# Altium project Les Soupapes de l'Extrême.PrjPcb
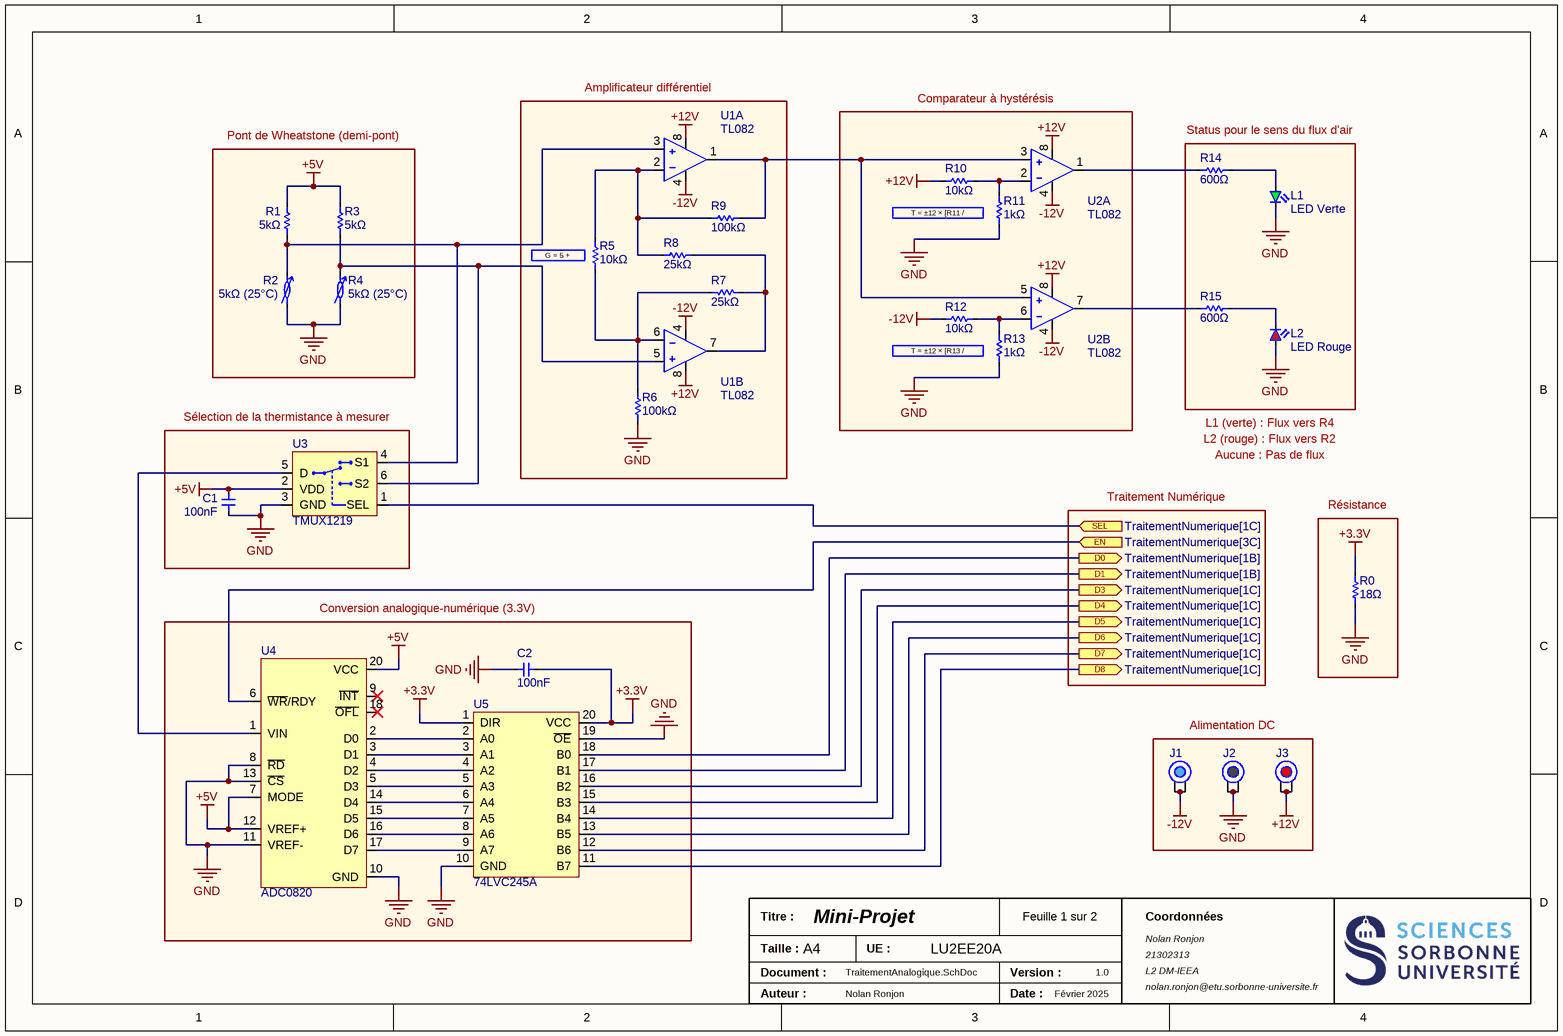
[diagram p0: TraitementAnalogique.SchDoc]
2 sheets, 66 parts. Net scope: flat (ports and power ports of the same name join across sheets).
Board file: Bobokeros.PcbDoc
Sheets:
  TraitementAnalogique.SchDoc
  TraitementNumerique.SchDoc

## Sheet TraitementAnalogique.SchDoc: Mini-Projet
size A4; Date: Février 2025; Author: Nolan Ronjon; CompanyName: Coordonnées; Address1: Nolan Ronjon; Address2: 21302313; Address3: L2 DM-IEEA; Address4: nolan.ronjon@etu.sorbonne-universite.fr; DocumentNumber: Schematic.SchDoc; Revision: 1.0; SheetNumber: 1; SheetTotal: 2; ProjectTitle: LU2EE20A; SPICEModelCacheHFZDDCNV: <root> / <DocumentId>HFZDDCNV</DocumentId> / </root>

### Parts
C1  value 100nF  [0603]  (hidden comment: Condensateur)
C2  value 100nF  [0603]  (hidden comment: Condensateur)
J1  Fiche Banane  [Fiche Banane]  (value not drawn)
J2  Fiche Banane  [Fiche Banane]  (value not drawn)
J3  Fiche Banane  [Fiche Banane]  (value not drawn)
L1  LED Verte  [0603 (Pol)]
L2  LED Rouge  [0603 (Pol)]
R0  value 18Ω  [Bornier]  (hidden comment: Resistance)
R1  value 5kΩ  [0603]  (hidden comment: Resistance)
R2  value 5kΩ (25°C)  [Bornier]  (hidden comment: CTN)
R3  value 5kΩ  [0603]  (hidden comment: Resistance)
R4  value 5kΩ (25°C)  [Bornier]  (hidden comment: CTN)
R5  value 10kΩ  [0603]  (hidden comment: Resistance)
R6  value 100kΩ  [0603]  (hidden comment: Resistance)
R7  value 25kΩ  [0603]  (hidden comment: Resistance)
R8  value 25kΩ  [0603]  (hidden comment: Resistance)
R9  value 100kΩ  [0603]  (hidden comment: Resistance)
R10  value 10kΩ  [0603]  (hidden comment: Resistance)
R11  value 1kΩ  [0603]  (hidden comment: Resistance)
R12  value 10kΩ  [0603]  (hidden comment: Resistance)
R13  value 1kΩ  [0603]  (hidden comment: Resistance)
R14  value 600Ω  [0603]  (hidden comment: Resistance)
R15  value 600Ω  [0603]  (hidden comment: Resistance)
U1  TL082  [SOIC-8]  (parts A,B of 2)
U2  TL082  [SOIC-8]  (parts A,B of 2)
U3  TMUX1219  [SOT-23-6]
U4  ADC0820  [DIP-20]
U5  74LVC245A  [TSSOP-20]

### Blocks framed on the sheet
Amplificateur différentiel: R5-R9 U1
Comparateur à hystérésis: R10-R13 U2
Pont de Wheatstone (demi-pont): R1-R4
Status pour le sens du flux d'air: L1 L2 R14 R15
Sélection de la thermistance à mesurer: C1 U3
Résistance: R0
Conversion analogique-numérique (3.3V): C2 U4 U5
Alimentation DC: J1-J3

### Ports
D0 (out, see TraitementNumerique[1B]), D1 (out, see TraitementNumerique[1B]), D3 (out, see TraitementNumerique[1C]), D4 (out, see TraitementNumerique[1C]), D5 (out, see TraitementNumerique[1C]), D6 (out, see TraitementNumerique[1C]), D7 (out, see TraitementNumerique[1C]), D8 (out, see TraitementNumerique[1C]), EN (in, see TraitementNumerique[3C]), SEL (in, see TraitementNumerique[1C])

### Nets
+3.3V: C2.2 R0.2 U5.1(DIR) U5.20(VCC)
+5V: C1.1 R1.2 R3.2 U3.2(VDD) U4.7(MODE) U4.12(VREF+) U4.20(VCC)
+12V: J3.1 J3.2 R10.2 U1.8(VCC+) U2.8(VCC+)
-12V: J1.1 J1.2 R12.2 U1.4(VCC-) U2.4(VCC-)
GND: C1.2 C2.1 J2.1 J2.2 L1.2(Cathode) L2.1(Anode) R0.1 R2.1 R4.1 R6.1 R11.1 R13.1 U3.3(GND) U4.8(~{RD}) U4.10(GND) U4.11(VREF-) U4.13(~{CS}) U5.10(GND) U5.19(~{OE})
NetL1_1: L1.1(Anode) R14.1
NetL2_2: L2.2(Cathode) R15.1
NetR1_1: R1.1 R2.2 U1.3(IN+) U3.4(S1)
NetR3_1: R3.1 R4.2 U1.5(IN+) U3.6(S2)
NetR5_1: R5.1 R6.2 R7.2 U1.6(IN-)
NetR5_2: R5.2 R8.2 R9.2 U1.2(IN-)
NetR7_1: R7.1 R8.1 U1.7(OUT)
NetR9_1: R9.1 U1.1(OUT) U2.3(IN+) U2.5(IN+)
NetR10_1: R10.1 R11.2 U2.2(IN-)
NetR12_1: R12.1 R13.2 U2.6(IN-)
NetR14_2: R14.2 U2.1(OUT)
NetR15_2: R15.2 U2.7(OUT)
NetU3_1: U3.1(SEL) ; port SEL
NetU3_5: U3.5(D) U4.1(VIN)
NetU4_2: U4.2(D0) U5.2(A0)
NetU4_3: U4.3(D1) U5.3(A1)
NetU4_4: U4.4(D2) U5.4(A2)
NetU4_5: U4.5(D3) U5.5(A3)
NetU4_6: U4.6(~{WR}/RDY) ; port EN
NetU4_14: U4.14(D4) U5.6(A4)
NetU4_15: U4.15(D5) U5.7(A5)
NetU4_16: U4.16(D6) U5.8(A6)
NetU4_17: U4.17(D7) U5.9(A7)
NetU5_11: U5.11(B7) ; port D8
NetU5_12: U5.12(B6) ; port D7
NetU5_13: U5.13(B5) ; port D6
NetU5_14: U5.14(B4) ; port D5
NetU5_15: U5.15(B3) ; port D4
NetU5_16: U5.16(B2) ; port D3
NetU5_17: U5.17(B1) ; port D1
NetU5_18: U5.18(B0) ; port D0

Not connected (* = marked no-connect by the designer): U4 9(~{INT})* 18(~{OFL})*

### Notes on the sheet
- T = ±12 × [R11 / (R10+R11)]
- (near R5) G = 5 + 200k/R5
- T = ±12 × [R13 / (R12+R13)]
- L1 (verte) : Flux vers R4
- L2 (rouge) : Flux vers R2
- Aucune : Pas de flux
- Traitement Numérique
- Titre :
- Taille :
- Auteur :
- Document :
- A4
- UE :
- Date :
- Version :

### Library data of the parts
J1 = Fiche Banane: Connecteur; Manufacturer Part: 24.243.5; JLCPCB Part: C7437325
J2 = Fiche Banane: Connecteur; Manufacturer Part: 24.243.2; JLCPCB Part: C7437322
J3 = Fiche Banane: Connecteur; Manufacturer Part: 24.243.1; JLCPCB Part: C7437321
L1 = LED Verte: LED; Manufacturer Part: XL-1608UGC-04; JLCPCB Part: C965804
L2 = LED Rouge: LED; Manufacturer Part: XL-1608SURC-06; JLCPCB Part: C965799
R0 = Resistance: Manufacturer Part: WJ500V-5.08-2P; JLCPCB Part: C8465
R2 R4 = CTN: Thermistance; Manufacturer Part: WJ500V-5.08-2P; JLCPCB Part: C8465
U1 U2 = TL082: AOP; Manufacturer Part: TL082IDR; JLCPCB Part: C6966
U3 = TMUX1219: Multiplexeur analogique; Manufacturer Part: TMUX1219DBVR; JLCPCB Part: C2869838
U4 = ADC0820: CAN (8 bit); Manufacturer Part: DS1001-01-20BT1NSF6S-JKB; JLCPCB Part: C72127
U5 = 74LVC245A: Buffer bidirectionnel; Manufacturer Part: SN74LVC245APWR; JLCPCB Part: C7848

## Sheet TraitementNumerique.SchDoc: Mini-Projet
size A4 portrait; Date: Février 2025; Author: Nolan Ronjon; CompanyName: Coordonnées; Address1: Nolan Ronjon; Address2: 21302313; Address3: L2 DM-IEEA; Address4: nolan.ronjon@etu.sorbonne-universite.fr; DocumentNumber: Schematic.SchDoc; Revision: 1.0; SheetNumber: 2; SheetTotal: 2; ProjectTitle: LU2EE20A; SPICEModelCacheHFZDDCNV: <root> / <DocumentId>HFZDDCNV</DocumentId> / </root>
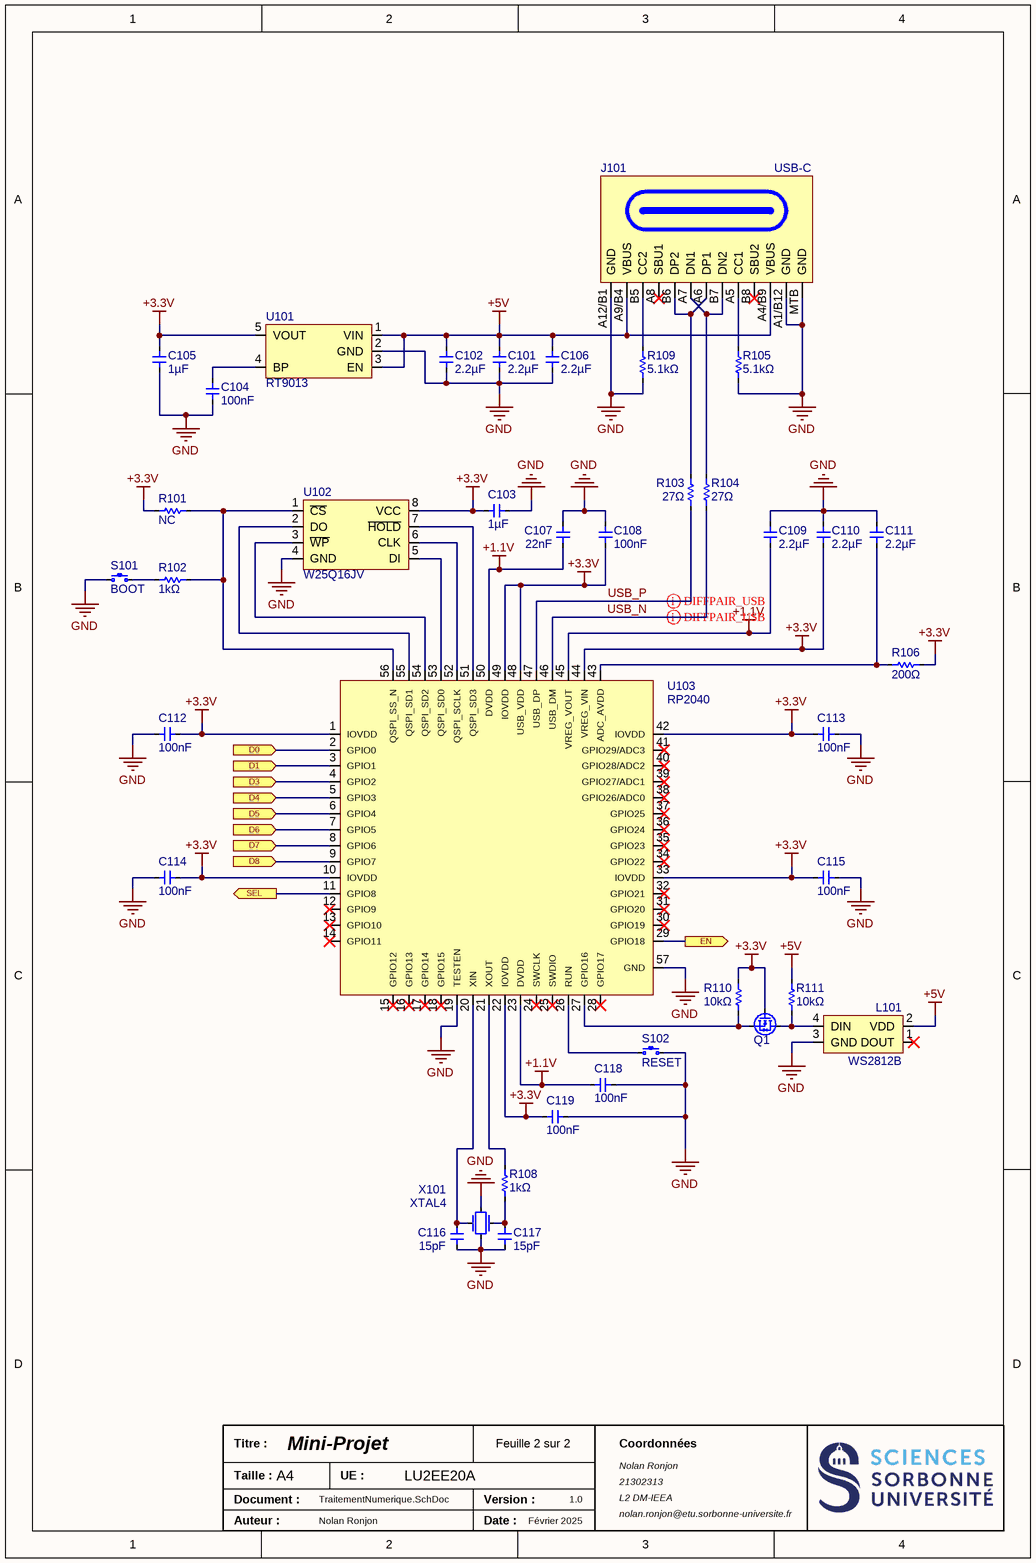
[diagram p1: TraitementNumerique.SchDoc]

### Parts
C101  value 2.2µF  [0603]  (hidden comment: Condensateur)
C102  value 2.2µF  [0603]  (hidden comment: Condensateur)
C103  value 1µF  [0603]  (hidden comment: Condensateur)
C104  value 100nF  [0603]  (hidden comment: Condensateur)
C105  value 1µF  [0603]  (hidden comment: Condensateur)
C106  value 2.2µF  [0603]  (hidden comment: Condensateur)
C107  value 22nF  [0603]  (hidden comment: Condensateur)
C108  value 100nF  [0603]  (hidden comment: Condensateur)
C109  value 2.2µF  [0603]  (hidden comment: Condensateur)
C110  value 2.2µF  [0603]  (hidden comment: Condensateur)
C111  value 2.2µF  [0603]  (hidden comment: Condensateur)
C112  value 100nF  [0603]  (hidden comment: Condensateur)
C113  value 100nF  [0603]  (hidden comment: Condensateur)
C114  value 100nF  [0603]  (hidden comment: Condensateur)
C115  value 100nF  [0603]  (hidden comment: Condensateur)
C116  value 15pF  [0603]  (hidden comment: Condensateur)
C117  value 15pF  [0603]  (hidden comment: Condensateur)
C118  value 100nF  [0603]  (hidden comment: Condensateur)
C119  value 100nF  [0603]  (hidden comment: Condensateur)
J101  USB-C  [USB-C]
L101  WS2812B  [SMD1615]
Q1  2N7002  [SOT-23]  (value not drawn)
R101  value NC  [0603]  (hidden comment: Resistance)
R102  value 1kΩ  [0603]  (hidden comment: Resistance)
R103  value 27Ω  [0603]  (hidden comment: Resistance)
R104  value 27Ω  [0603]  (hidden comment: Resistance)
R105  value 5.1kΩ  [0603]  (hidden comment: Resistance)
R106  value 200Ω  [0603]  (hidden comment: Resistance)
R108  value 1kΩ  [0603]  (hidden comment: Resistance)
R109  value 5.1kΩ  [0603]  (hidden comment: Resistance)
R110  value 10kΩ  [0603]  (hidden comment: Resistance)
R111  value 10kΩ  [0603]  (hidden comment: Resistance)
S101  BOOT  [Bouton]
S102  RESET  [Bouton]
U101  RT9013  [SOT-23-5]
U102  W25Q16JV  [USON-8]
U103  RP2040  [QFN-56]
X101  XTAL4  [SMD3225]

### Ports
D0 (in, see TraitementAnalogique[3C]), D1 (in, see TraitementAnalogique[3C]), D3 (in, see TraitementAnalogique[3C]), D4 (in, see TraitementAnalogique[3C]), D5 (in, see TraitementAnalogique[3C]), D6 (in, see TraitementAnalogique[3C]), D7 (in, see TraitementAnalogique[3C]), D8 (in, see TraitementAnalogique[3C]), EN (out, see TraitementAnalogique[3C]), SEL (out, see TraitementAnalogique[3C])

### Nets
+1.1V: C107.2 C109.2 C118.2 U103.23(DVDD) U103.45(VREG_VOUT) U103.50(DVDD)
+3.3V: C103.2 C105.1 C108.2 C110.2 C112.2 C113.2 C114.2 C115.2 C119.2 Q1.1(G) R101.2 R106.1 R110.2 U101.5(VOUT) U102.8(VCC) U103.1(IOVDD) U103.10(IOVDD) U103.22(IOVDD) U103.33(IOVDD) U103.42(IOVDD) U103.44(VREG_VIN) U103.48(USB_VDD) U103.49(IOVDD)
+5V: C101.1 C102.1 C106.1 J101.A4/B9(VBUS) J101.A9/B4(VBUS) L101.2(VDD) R111.2 U101.1(VIN) U101.3(EN)
GND: C101.2 C102.2 C103.1 C104.2 C105.2 C106.2 C107.1 C108.1 C109.1 C110.1 C111.1 C112.1 C113.1 C114.1 C115.1 C116.2 C117.2 C118.1 C119.1 J101.A1/B12(GND) J101.A12/B1(GND) J101.MTB(GND) L101.3(GND) R105.1 R109.1 S101.1 S102.2 U101.2(GND) U102.4(GND) U103.19(TESTEN) U103.57(GND) X101.2(GND_1) X101.4(GND_2)
USB_N: R104.1 U103.46(USB_DM)
USB_P: R103.1 U103.47(USB_DP)
NetC104_1: C104.1 U101.4(BP)
NetC111_2: C111.2 R106.2 U103.43(ADC_AVDD)
NetC116_1: C116.1 U103.20(XIN) X101.1(CRYSTAL_1)
NetC117_1: C117.1 R108.1 X101.3(CRYSTAL_2)
NetJ101_A5: J101.A5(CC1) R105.2
NetJ101_A6: J101.A6(DP1) J101.B6(DP2) R103.2
NetJ101_A7: J101.A7(DN1) J101.B7(DN2) R104.2
NetJ101_B5: J101.B5(CC2) R109.2
NetL101_4: L101.4(DIN) Q1.3(D) R111.1
NetQ1_2: Q1.2(S) R110.1 U103.27(GPIO16)
NetR101_1: R101.1 R102.1 U102.1(~{CS}) U103.56(QSPI_SS_N)
NetR102_2: R102.2 S101.2
NetR108_2: R108.2 U103.21(XOUT)
NetS102_1: S102.1 U103.26(RUN)
NetU3_1: U103.11(GPIO8) ; port SEL
NetU4_6: U103.29(GPIO18) ; port EN
NetU5_11: U103.9(GPIO7) ; port D8
NetU5_12: U103.8(GPIO6) ; port D7
NetU5_13: U103.7(GPIO5) ; port D6
NetU5_14: U103.6(GPIO4) ; port D5
NetU5_15: U103.5(GPIO3) ; port D4
NetU5_16: U103.4(GPIO2) ; port D3
NetU5_17: U103.3(GPIO1) ; port D1
NetU5_18: U103.2(GPIO0) ; port D0
NetU102_2: U102.2(DO) U103.55(QSPI_SD1)
NetU102_3: U102.3(~{WP}) U103.54(QSPI_SD2)
NetU102_5: U102.5(DI) U103.53(QSPI_SD0)
NetU102_6: U102.6(CLK) U103.52(QSPI_SCLK)
NetU102_7: U102.7(~{HOLD}) U103.51(QSPI_SD3)

Not connected (* = marked no-connect by the designer): J101 A8(SBU1)* B8(SBU2)*; L101 1(DOUT)*; U103 12(GPIO9)* 13(GPIO10)* 14(GPIO11)* 15(GPIO12)* 16(GPIO13)* 17(GPIO14)* 18(GPIO15)* 24(SWCLK)* 25(SWDIO)* 28(GPIO17)* 30(GPIO19)* 31(GPIO20)* 32(GPIO21)* 34(GPIO22)* 35(GPIO23)* 36(GPIO24)* 37(GPIO25)* 38(GPIO26/ADC0)* 39(GPIO27/ADC1)* 40(GPIO28/ADC2)* 41(GPIO29/ADC3)*

### Layout directives
differential pair: USB_N, USB_P

### Notes on the sheet
- Titre :
- Taille :
- Auteur :
- Document :
- A4
- UE :
- Date :
- Version :

### Library data of the parts
J101 = USB-C: Connecteur; Manufacturer Part: TYPE-C-31-M-12; JLCPCB Part: C165948
L101 = WS2812B: LED RGB; Manufacturer Part: XL-1615RGBC-WS2812B; JLCPCB Part: C5349954
Q1 = 2N7002: MOSFET; Manufacturer Part: 2N7002K-7; JLCPCB Part: C85047
S101 S102 = Bouton: Manufacturer Part: TS-1088-AR02016; JLCPCB Part: C720477
U101 = RT9013: Régulateur de tension; Manufacturer Part: RT9013-33GB; JLCPCB Part: C47773
U102 = W25Q16JV: Flash; Manufacturer Part: W25Q16JVUXIQ; JLCPCB Part: C2843335
U103 = RP2040: Microcontroleur; Manufacturer Part: RP2040; JLCPCB Part: C2040
X101 = XTAL4: Crystal; Manufacturer Part: ABM8-272-T3; Value: 12MHz; JLCPCB Part: C20625731

## Nets that join several sheets
+3.3V: TraitementAnalogique (C2.2 R0.2 U5.1 U5.20), TraitementNumerique (23 pins)
+5V: TraitementAnalogique (7 pins), TraitementNumerique (9 pins)
GND: TraitementAnalogique (19 pins), TraitementNumerique (33 pins)
NetU3_1: TraitementAnalogique (U3.1), TraitementNumerique (U103.11)
NetU4_6: TraitementAnalogique (U4.6), TraitementNumerique (U103.29)
NetU5_11: TraitementAnalogique (U5.11), TraitementNumerique (U103.9)
NetU5_12: TraitementAnalogique (U5.12), TraitementNumerique (U103.8)
NetU5_13: TraitementAnalogique (U5.13), TraitementNumerique (U103.7)
NetU5_14: TraitementAnalogique (U5.14), TraitementNumerique (U103.6)
NetU5_15: TraitementAnalogique (U5.15), TraitementNumerique (U103.5)
NetU5_16: TraitementAnalogique (U5.16), TraitementNumerique (U103.4)
NetU5_17: TraitementAnalogique (U5.17), TraitementNumerique (U103.3)
NetU5_18: TraitementAnalogique (U5.18), TraitementNumerique (U103.2)